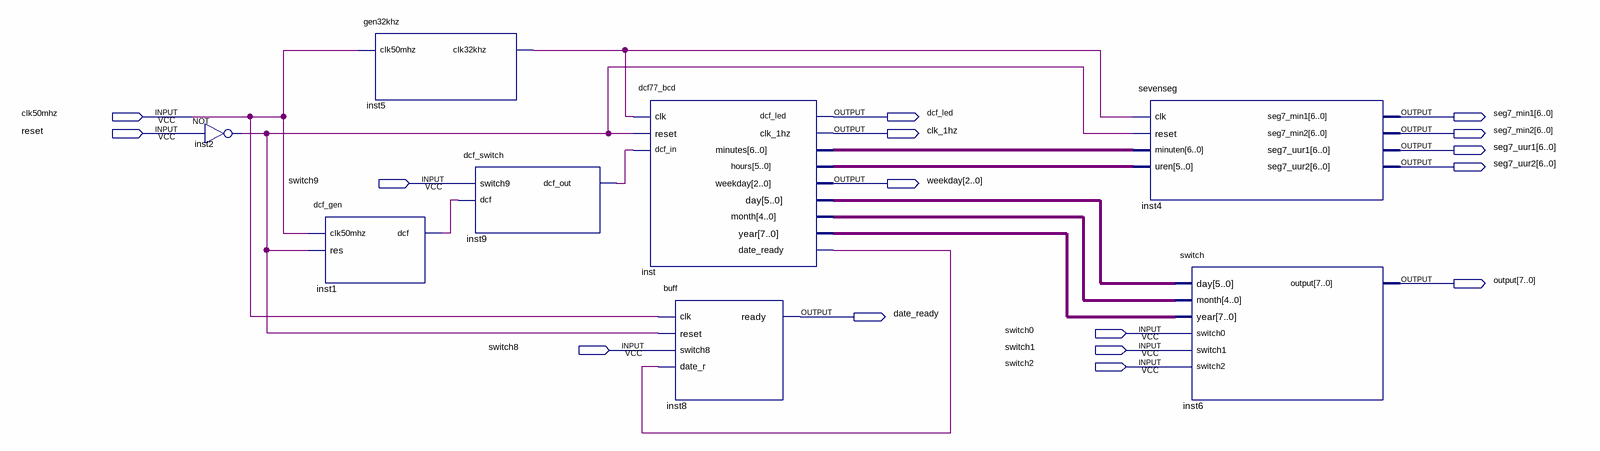
[diagram p0: schematic sheet]
// Quartus schematic dcf77.bdf as structural Verilog: 8 symbols, 16 pins
module dcf77 (
  input  clk50mhz,
  input  reset,
  input  switch9,
  input  switch0,
  input  switch8,
  input  switch1,
  input  switch2,
  output dcf_led,
  output [6:0] seg7_min1,
  output clk_1hz,
  output [6:0] seg7_min2,
  output [6:0] seg7_uur1,
  output [6:0] seg7_uur2,
  output [2:0] weekday,
  output [7:0] \output ,
  output date_ready
);

  wire inst1_dcf, inst2_out, inst5_clk32khz, inst9_dcf_out, inst_date_ready;
  wire [4:0] inst_month;
  wire [5:0] inst_day, inst_hours;
  wire [6:0] inst_minutes;
  wire [7:0] inst_year;

  not inst2 (inst2_out, reset);
  dcf_gen inst1 (.clk50mhz(clk50mhz), .res(inst2_out), .dcf(inst1_dcf));
  gen32khz inst5 (.clk50mhz(clk50mhz), .clk32khz(inst5_clk32khz));
  dcf_switch inst9 (.switch9(switch9), .dcf(inst1_dcf), .dcf_out(inst9_dcf_out));
  dcf77_bcd inst (
    .clk(inst5_clk32khz), .reset(inst2_out), .dcf_in(inst9_dcf_out), .dcf_led(dcf_led), .clk_1hz(clk_1hz),
    .minutes(inst_minutes), .hours(inst_hours), .weekday(weekday), .day(inst_day), .month(inst_month),
    .year(inst_year), .date_ready(inst_date_ready));
  buff inst8 (.clk(clk50mhz), .reset(inst2_out), .switch8(switch8), .date_r(inst_date_ready), .ready(date_ready));
  sevenseg inst4 (
    .clk(inst5_clk32khz), .reset(inst2_out), .minuten(inst_minutes), .uren(inst_hours),
    .seg7_min1(seg7_min1), .seg7_min2(seg7_min2), .seg7_uur1(seg7_uur1), .seg7_uur2(seg7_uur2));
  switch inst6 (
    .day(inst_day), .month(inst_month), .year(inst_year), .switch0(switch0), .switch1(switch1),
    .switch2(switch2), .\output (\output ));
endmodule
